# EAGLE design L298_driver (EAGLE 6.1)
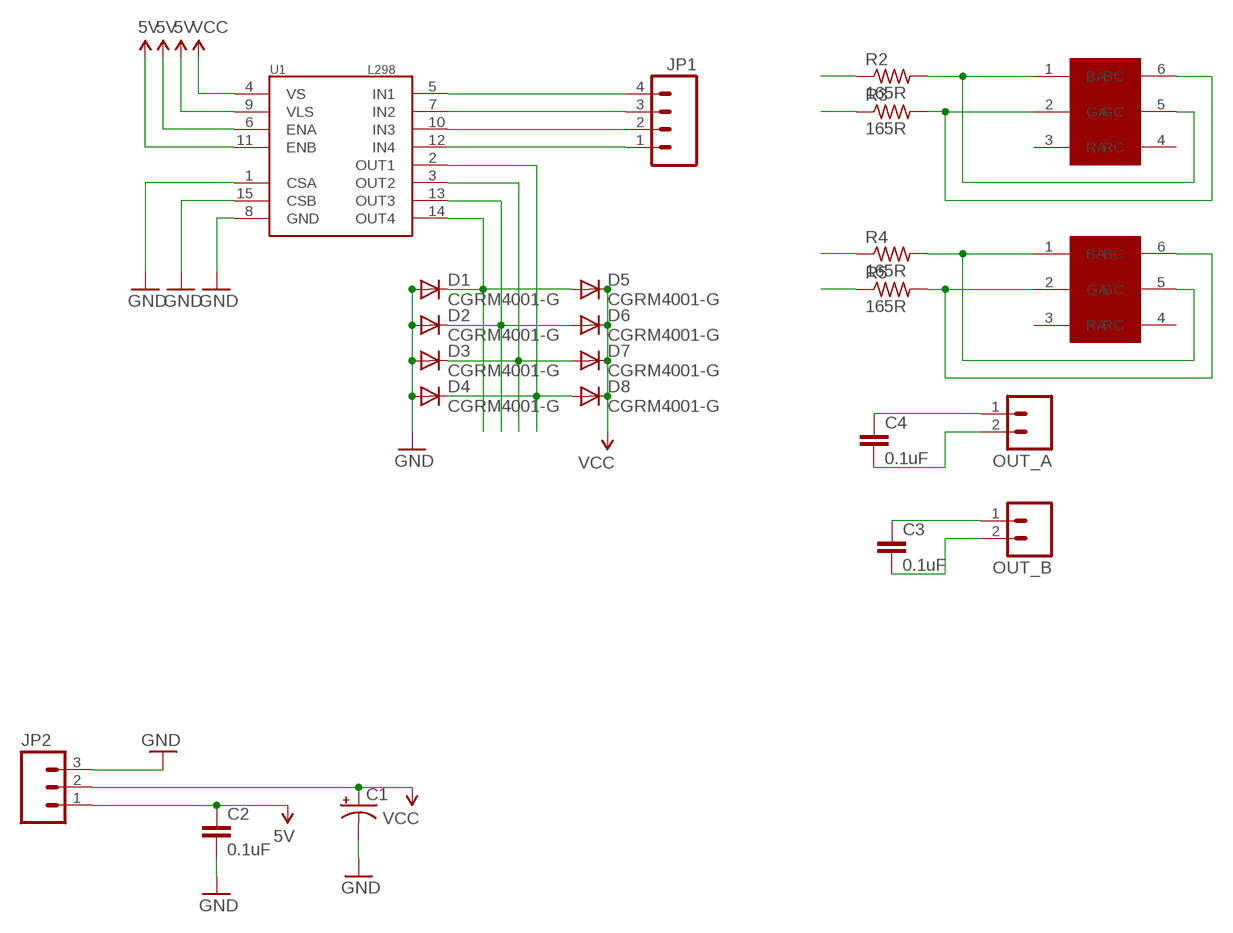
[diagram p0: schematic, sheet 1]

## Parts
C1  CPOL-USTT5D11L  [TT5D11L]
C2  0.1uF  CAP0402-CAP  [0402-CAP]
C3  0.1uF  CAP0402-CAP  [0402-CAP]
C4  0.1uF  CAP0402-CAP  [0402-CAP]
D1  CGRM4001-G  [SOD-123_MINI-SMA]
D2  CGRM4001-G  [SOD-123_MINI-SMA]
D3  CGRM4001-G  [SOD-123_MINI-SMA]
D4  CGRM4001-G  [SOD-123_MINI-SMA]
D5  CGRM4001-G  [SOD-123_MINI-SMA]
D6  CGRM4001-G  [SOD-123_MINI-SMA]
D7  CGRM4001-G  [SOD-123_MINI-SMA]
D8  CGRM4001-G  [SOD-123_MINI-SMA]
JP1  M04POLAR  [MOLEX-1X4]
JP2  M03-SCREW-5MM  [SCREWTERMINAL-5MM-3]
LED_A  LRTB_R98G  [6-SMD]
LED_B  LRTB_R98G  [6-SMD]
OUT_A  M025MM  [SCREWTERMINAL-5MM-2]
OUT_B  M025MM  [SCREWTERMINAL-5MM-2]
R2  165R  R-US_R0402  [R0402]
R3  165R  R-US_R0402  [R0402]
R4  165R  R-US_R0402  [R0402]
R5  165R  R-US_R0402  [R0402]
U1  L298  [MULTIWATT15]

## Nets
5V: C2.1 JP2.1 U1.6(ENA) U1.9(VLS) U1.11(ENB)
GND: C1.- C2.2 D1.A D2.A D3.A D4.A JP2.3 U1.1(CSA) U1.8(GND) U1.15(CSB)
IN1: JP1.4 R2.1 U1.5(IN1)
IN2: JP1.3 R3.1 U1.7(IN2)
IN3: JP1.2 R4.1 U1.10(IN3)
IN4: JP1.1 R5.1 U1.12(IN4)
N$1: LED_A.1(BA) LED_A.5(GC) R2.2
N$2: LED_A.2(GA) LED_A.6(BC) R3.2
N$3: LED_B.1(BA) LED_B.5(GC) R4.2
N$4: LED_B.2(GA) LED_B.6(BC) R5.2
OUT1: C4.1 D4.C D8.A OUT_A.1 U1.2(OUT1)
OUT2: C4.2 D3.C D7.A OUT_A.2 U1.3(OUT2)
OUT3: C3.1 D2.C D6.A OUT_B.1 U1.13(OUT3)
OUT4: C3.2 D1.C D5.A OUT_B.2 U1.14(OUT4)
VCC: C1.+ D5.C D6.C D7.C D8.C JP2.2 U1.4(VS)
Unconnected: LED_A.3(RA) LED_A.4(RC) LED_B.3(RA) LED_B.4(RC)

## Library data of the parts
C1 = resistor:CPOL-US: POLARIZED CAPACITOR, American symbol
C2-C4 = SparkFun-Passives:CAP: Capacitor Standard 0603 ceramic capacitor, and 0.1" leaded capacitor.
D1-D8 = diode:CGRM400*-G: Molded plasitc,JEDEC SOD-123/Mini SMA Source: Comchip CGRM4001-G.pdf
JP1 = SparkFun-Connectors:M04: Header 4 Standard 4-pin 0.1" header. Use with straight break away headers (SKU : PRT-00116), right angle break away headers (PRT-00553), swiss pins (PRT-00743), machine pins (PRT-00117), and female headers (PRT-00115). Molex polarized connector foot print use with SKU : PRT-08231 with associated crimp pins and housings. 1MM SMD Version SKU: PRT-10208
JP2 = SparkFun-Connectors:M03: Header 3 Standard 3-pin 0.1" header. Use with straight break away headers (SKU : PRT-00116), right angle break away headers (PRT-00553), swiss pins (PRT-00743), machine pins (PRT-00117), and female headers (PRT-00115). Molex polarized connector foot print use with SKU : PRT-08232 with associated crimp pins and housings.
LED_A LED_B = yoos:LRTB_R98G
OUT_A OUT_B = SparkFun-Connectors:M02: Header 2 Standard 2-pin 0.1" header. Use with straight break away headers (SKU : PRT-00116), right angle break away headers (PRT-00553), swiss pins (PRT-00743), machine pins (PRT-00117), and female headers (PRT-00115). Molex polarized connector foot print use with SKU : PRT-08233 with associated crimp pins and housings.
R2-R5 = resistor:R-US_: RESISTOR, American symbol
U1 = SparkFun-PowerIC:L298: L298 Dual Full Bridge Driver

## Board
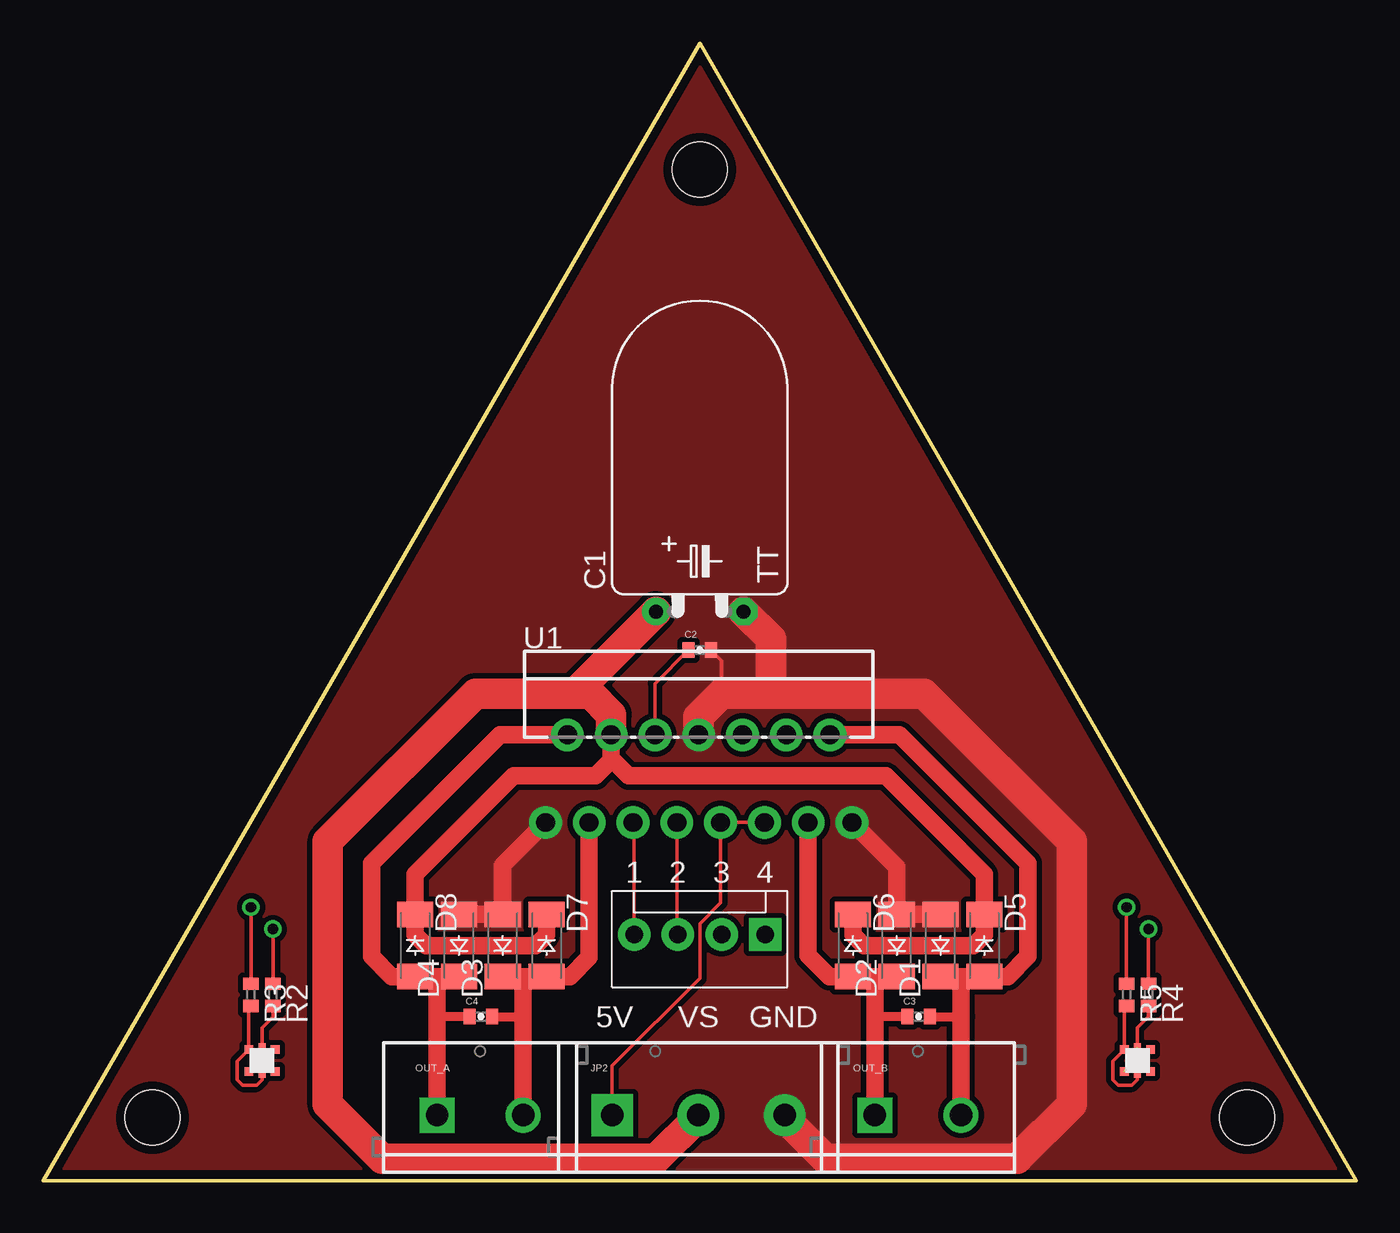
[diagram p1: board, top side]
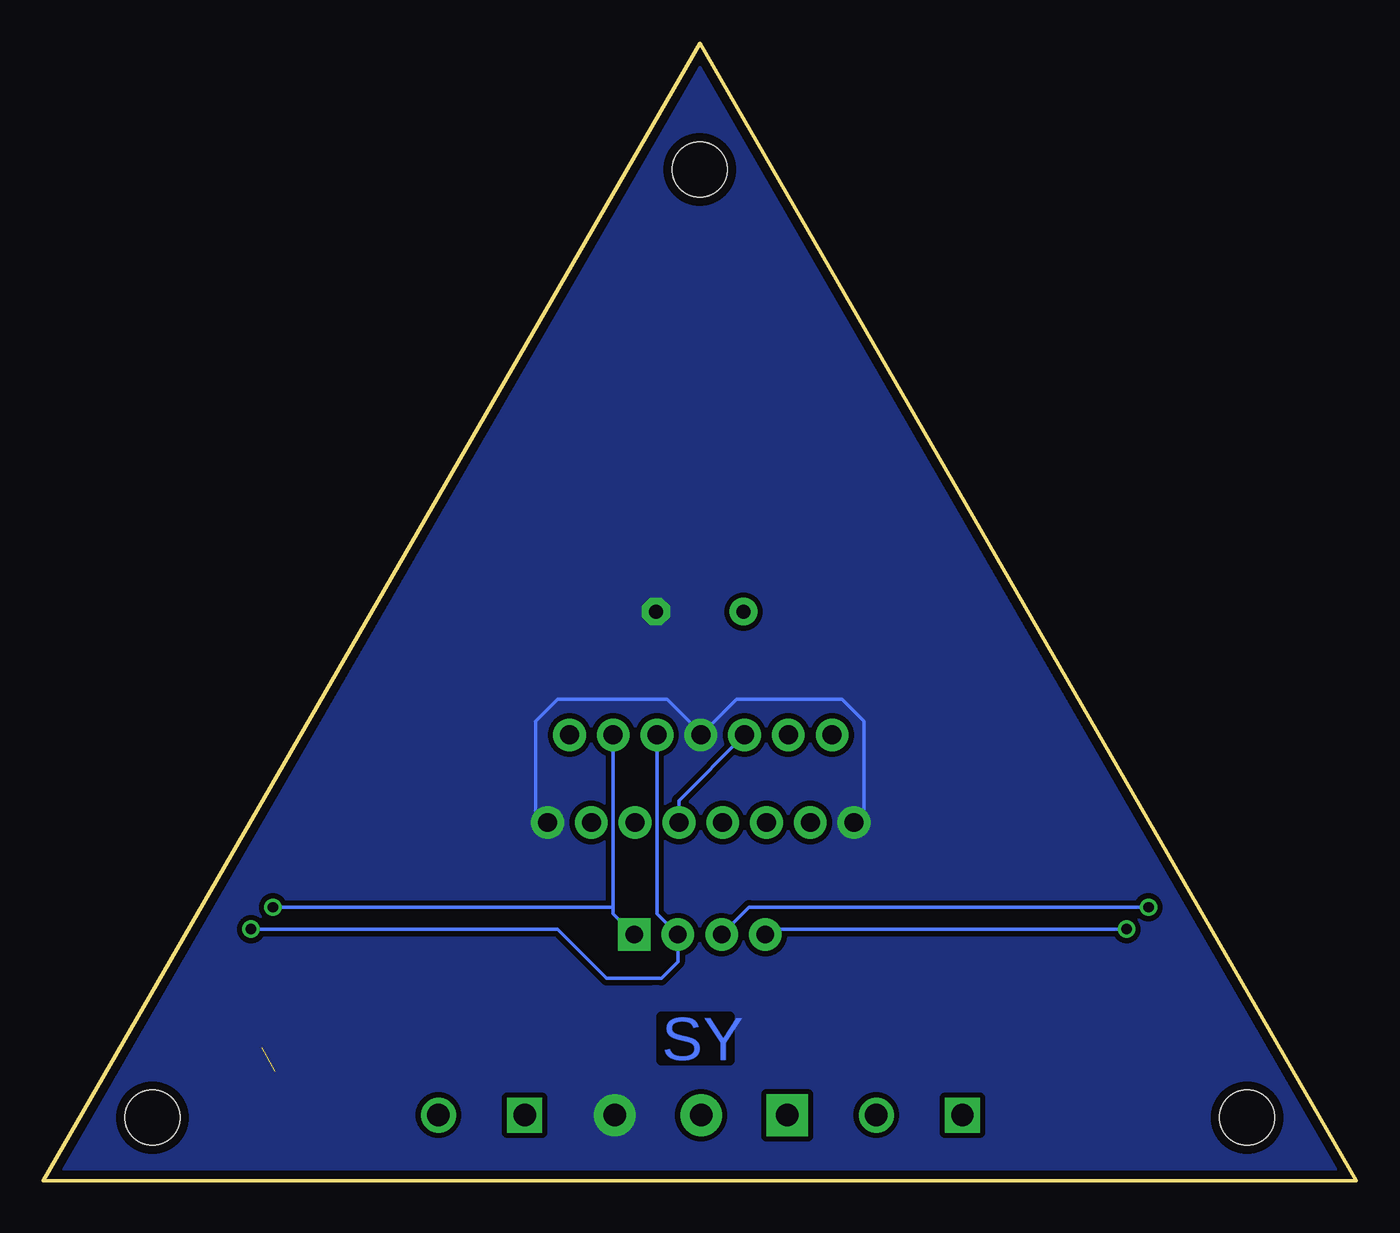
[diagram p2: board, bottom side, seen from below]

Size 76.2 x 65.99 mm. Coordinates in mm from the lower left corner, seen from the top.
Outline: 0,0 38.1,65.99 76.2,0
Outline: 76.2,0 0,0
Outline: 76.2,0 0,0
Copper layers (1*16): Top 0.035mm / dielectric 1.5mm / Bottom 0.035mm
Design rules: minimum track width 10mil, minimum drill 24mil, track to track 12mil, track to pad 12mil, pad to pad 8mil, via to via 8mil, smd to smd 8mil, copper to edge 20mil, drill to drill 8mil, minimum pad ring 10mil, minimum via ring 8mil, stop-mask expansion 4mil, vias tented up to drill 0mil, thermal gap 10mil
Holes 3.17 mm at 6.35,3.67 69.85,3.67 38.1,58.66

### Footprints (pad centres in the part's own frame; a part is rotated, then mirrored left to right if it is on the bottom)
TT5D11L = drill 0.813 pad 1.6: + -2.54,0 | drill 0.813 pad 1.6 octagon: - 2.54,0
0402-CAP = smd 0.7 x 0.9: 1 -0.65,0; 2 0.65,0
SOD-123_MINI-SMA = smd 1.5 x 2.1: A 1.8,0; C -1.8,0
MOLEX-1X4 = drill 1.016 pad 1.88 square: 1 0,0 | drill 1.016 pad 1.88: 2 2.54,0; 3 5.08,0; 4 7.62,0
SCREWTERMINAL-5MM-3 = drill 1.3 pad 2.413 square: 1 0,0 | drill 1.3 pad 2.413: 2 5,0; 3 10,0
6-SMD = smd 0.508 x 0.508: 1 -0.762,-0.635; 3 0.762,-0.635; 4 0.762,0.635; 6 -0.762,0.635 | smd 0.406 x 0.508: 2 0,-0.737; 5 0,0.737
SCREWTERMINAL-5MM-2 = drill 1.3 pad 2.032 square: 1 0,0 | drill 1.3 pad 2.032: 2 5,0
R0402 = smd 0.7 x 0.9: 1 -0.65,0; 2 0.65,0
MULTIWATT15 = drill 1.1 pad 1.9: 1 -8.95,-2.39; 2 -7.68,2.69; 3 -6.41,-2.39; 4 -5.14,2.69; 5 -3.87,-2.39; 6 -2.6,2.69; 7 -1.33,-2.39; 8 -0.06,2.69; 9 1.21,-2.39; 10 2.48,2.69; 11 3.75,-2.39; 12 5.02,2.69; 13 6.29,-2.39; 14 7.56,2.69; 15 8.83,-2.39

### Placement (x,y rotation side)
C1  38.1,33.02 0 top
C2  38.1,30.8 0 top
C3  50.8,9.53 0 top
C4  25.4,9.53 0 top
D1  52.07,13.65 90 top
D2  49.53,13.65 90 top
D3  26.67,13.65 90 top
D4  24.13,13.65 90 top
D5  54.61,13.65 270 top
D6  46.99,13.65 270 top
D7  29.21,13.65 270 top
D8  21.59,13.65 270 top
JP1  41.91,14.29 180 top
JP2  33.02,3.81 0 top
LED_A  12.7,6.99 0 top
LED_B  63.5,6.99 0 top
OUT_A  22.86,3.81 0 top
OUT_B  48.26,3.81 0 top
R2  13.34,10.79 270 top
R3  12.06,10.79 270 top
R4  64.14,10.79 270 top
R5  62.87,10.79 270 top
U1  38.1,23.18 0 top

### Tracks (layer width: path | path; a pad name or v marks a point on that pad's centre or on a via)
5V
  Top 0.203: JP2.1 33.02,6.67 38.1,11.75 38.1,14.92 39.31,16.13 U1.9 U1.11 | C2.1 35.5,28.85 U1.6
  Bottom 0.203: U1.9 39.31,22.06 U1.6
GND
  Top 0.203: C2.2 39.37,30.18 39.37,28.26
  Top 1.016: D1.A D2.A 49.53,18.19 U1.15 | D4.A D3.A 26.67,18.31 U1.1
  Top 1.778: JP2.3 43.02,3.65 45.4,1.27 56.52,1.27 59.69,4.45 59.69,19.68 51.12,28.26 42.23,28.26 | U1.8 38.04,26.93 39.37,28.26 42.23,28.26 | C1.- 42.23,31.43 42.23,28.26
  Bottom 0.203: U1.1 28.57,21.36 28.57,26.67 29.84,27.94 35.97,27.94 U1.8 38.04,25.98 40.01,27.94 46.35,27.94 47.62,26.67 47.62,21.48 U1.15
  pour Top (no thermals): 0,0 0,66.04 76.2,66.04 76.2,0
  pour Bottom (no thermals): 0,0 0,66.04 76.2,66.04 76.2,0
IN1  (via drill 0.6)
  Top 0.203: v13.34,14.61 R2.1 | U1.5 34.29,20.73 JP1.4
  Bottom 0.203: JP1.4 33.97,14.61 v13.34,14.61
IN2  (via drill 0.6)
  Top 0.203: v12.06,15.88 R3.1 | JP1.3 v36.77,14.35 U1.7
  Bottom 0.203: v36.77,14.35 35.24,15.88 v12.06,15.88
IN3  (via drill 0.6)
  Top 0.203: v64.14,14.61 R4.1
  Bottom 0.203: U1.10 40.58,15.5 JP1.2 39.37,12.7 40.32,11.75 40.96,11.75 42.23,11.75 43.5,11.75 46.35,14.61 v64.14,14.61
IN4  (via drill 0.6)
  Top 0.203: v62.87,15.88 R5.1
  Bottom 0.203: JP1.1 43.12,15.5 43.12,15.88 | 43.12,15.88 U1.12 | v62.87,15.88 43.12,15.88
N$1
  Top 0.203: R2.2 13.34,9.53 12.7,8.89 LED_A.5 12.7,7.11 LED_A.1
N$2
  Top 0.203: R3.2 11.94,10.02 LED_A.6 11.27,6.95 11.27,5.87 11.59,5.56 12.38,5.56 12.7,5.87 LED_A.2
N$3  (1 unrouted)
  Top 0.203: LED_B.5 63.5,8.89 64.14,9.53 R4.2
N$4
  Top 0.203: R5.2 62.74,10.02 LED_B.6 62.07,6.95 62.07,5.87 62.39,5.56 63.18,5.56 63.5,5.87 LED_B.2
OUT1
  Top 0.508: C4.1 22.86,9.53
  Top 1.016: D4.C 22.54,11.85 | 22.54,11.85 D8.A 20.21,11.85 19.05,13.02 19.05,18.41 26.5,25.87 U1.2 | OUT_A.1 22.86,9.53 22.86,11.54 22.54,11.85
OUT2
  Top 0.508: C4.2 27.86,9.53
  Top 1.016: U1.3 31.69,12.96 30.59,11.85 D7.A 27.94,11.85 | 27.94,11.85 D3.C | OUT_A.2 27.86,9.53 27.86,11.77 27.94,11.85
OUT3
  Top 0.508: C3.1 48.26,9.53
  Top 1.016: D6.A 46.99,11.75 | U1.13 44.39,13.08 45.62,11.85 D6.A | D2.C 48.26,11.85 | 48.26,11.85 D6.A | OUT_B.1 48.26,9.53 48.26,11.85
OUT4
  Top 0.508: C3.2 53.26,9.53
  Top 1.016: 53.34,11.85 D5.A 55.98,11.85 57.15,13.02 57.15,18.41 49.7,25.87 U1.14 | 53.34,11.85 D1.C | OUT_B.2 53.26,9.53 53.26,11.77 53.34,11.85
VCC
  Top 1.016: D7.C 29.21,14.29 28.57,13.65 22.23,13.65 21.59,14.29 D8.C 21.59,17.78 27.3,23.5 32.07,23.5 32.96,24.39 | D6.C 46.99,14.29 47.62,13.65 53.98,13.65 54.61,14.29 D5.C 54.61,17.78 48.9,23.5 33.97,23.5 33.08,24.39 32.96,24.39 | U1.4 32.96,24.39
  Top 1.778: 38.02,3.73 JP2.2 38.02,3.73 | 38.02,3.73 35.56,1.27 19.68,1.27 16.51,4.45 16.51,19.68 25.08,28.26 30.8,28.26 | U1.4 32.96,27.05 31.75,28.26 30.8,28.26 | C1.+ 30.8,28.26

### Text on the board
Bottom: SY
tPlace: 1 | 2 | 3 | 4 | 5V | VS | GND